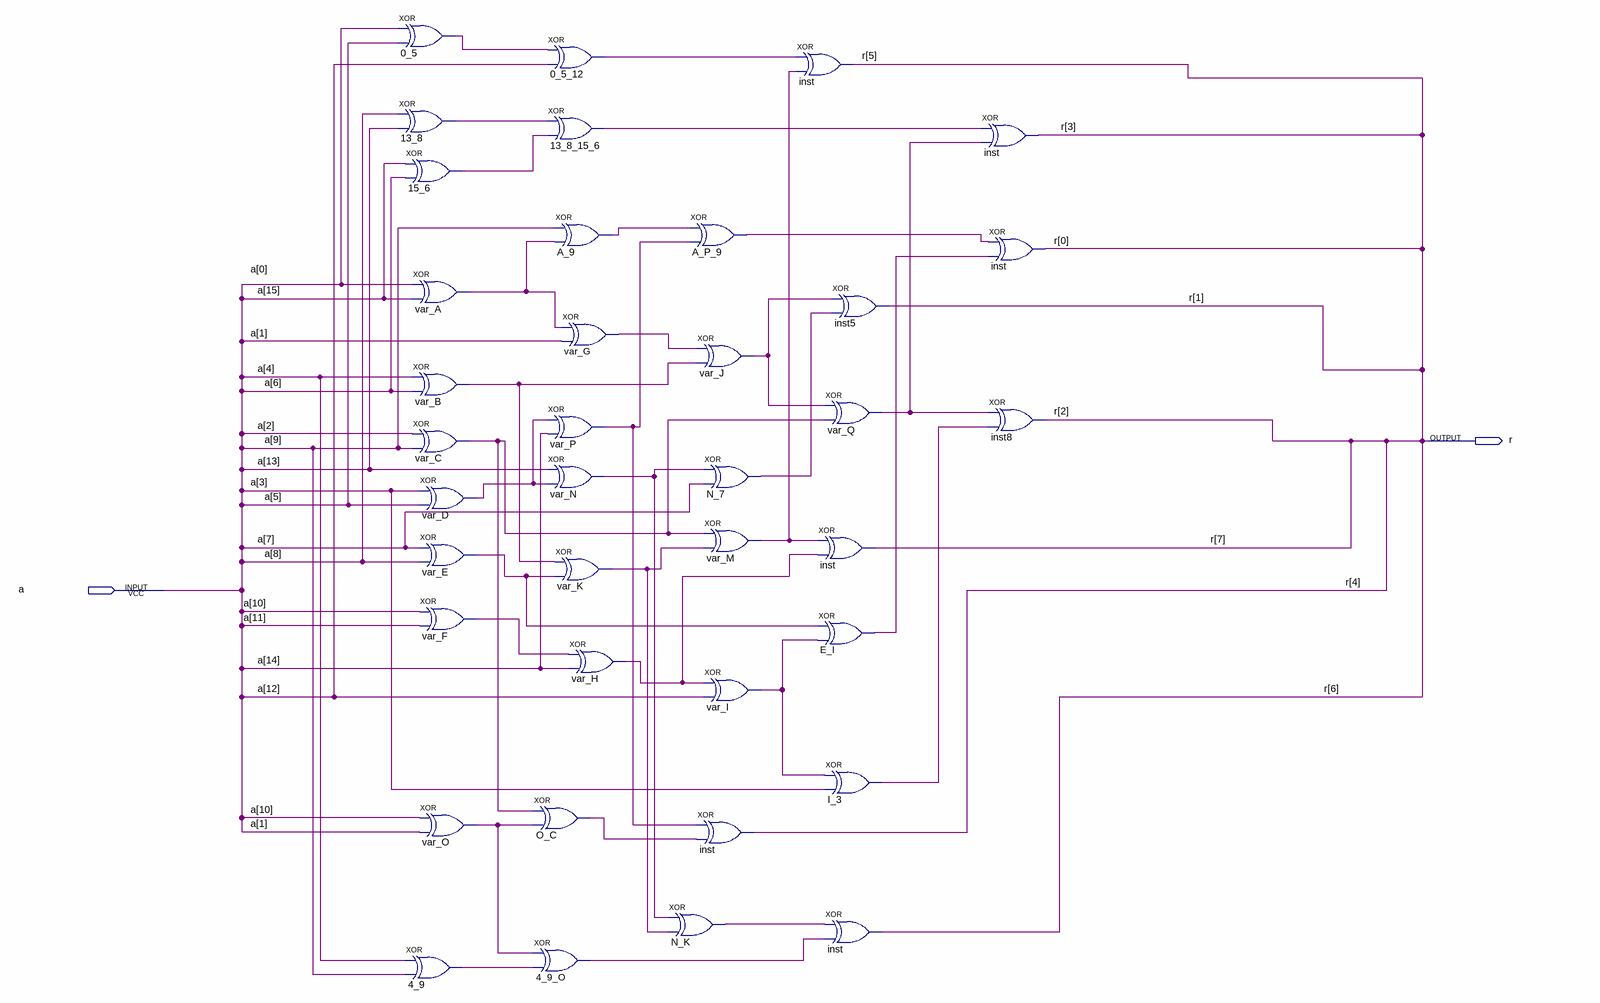
[diagram p0: schematic sheet]
// Quartus schematic EncoderBDF.bdf as structural Verilog: 38 symbols, 2 pins
module EncoderBDF (
  input  a,
  output r
);

  wire A_9_out, A_P_9_out, E_I_out, I_3_out, n0_5_12_out, n0_5_out, n4_9_O_out, n4_9_out, n13_8_15_6_out,
       n13_8_out, n15_6_out, N_7_out, N_K_out, O_C_out, var_A_out, var_B_out, var_C_out, var_D_out,
       var_E_out, var_F_out, var_G_out, var_H_out, var_I_out, var_J_out, var_K_out, var_M_out, var_N_out,
       var_O_out, var_P_out, var_Q_out;

  xor u_0_5 (n0_5_out, a, a);
  xor u_13_8 (n13_8_out, a, a);
  xor u_15_6 (n15_6_out, a, a);
  xor u_4_9 (n4_9_out, a, a);
  xor var_A (var_A_out, a, a);
  xor var_B (var_B_out, a, a);
  xor var_C (var_C_out, a, a);
  xor var_D (var_D_out, a, a);
  xor var_E (var_E_out, a, a);
  xor var_F (var_F_out, a, a);
  xor var_O (var_O_out, a, a);
  xor u_0_5_12 (n0_5_12_out, n0_5_out, a);
  xor u_13_8_15_6 (n13_8_15_6_out, n13_8_out, n15_6_out);
  xor A_9 (A_9_out, a, var_A_out);
  xor var_G (var_G_out, var_A_out, a);
  xor var_P (var_P_out, var_D_out, a);
  xor var_N (var_N_out, a, var_D_out);
  xor var_K (var_K_out, var_B_out, var_E_out);
  xor var_H (var_H_out, var_F_out, a);
  xor O_C (O_C_out, var_C_out, var_O_out);
  xor u_4_9_O (n4_9_O_out, var_O_out, n4_9_out);
  xor A_P_9 (A_P_9_out, A_9_out, var_P_out);
  xor N_K (N_K_out, var_N_out, var_K_out);
  xor var_J (var_J_out, var_G_out, var_B_out);
  xor N_7 (N_7_out, var_N_out, a);
  xor var_M (var_M_out, var_C_out, var_K_out);
  xor var_I (var_I_out, var_H_out, a);
  xor inst (r, var_P_out, O_C_out);
  xor inst_dup2 (r, n0_5_12_out, var_M_out);
  xor inst5 (r, var_J_out, N_7_out);
  xor var_Q (var_Q_out, var_J_out, var_C_out);
  xor inst_dup3 (r, var_M_out, var_H_out);
  xor E_I (E_I_out, var_E_out, var_I_out);
  xor I_3 (I_3_out, var_I_out, a);
  xor inst_dup4 (r, N_K_out, n4_9_O_out);
  xor inst_dup5 (r, n13_8_15_6_out, var_Q_out);
  xor inst_dup6 (r, A_P_9_out, E_I_out);
  xor inst8 (r, var_Q_out, I_3_out);

  // Other names for the same wires on the sheet: a[15:0] = {16{a}}; r[7:0] = {8{r}}
endmodule
